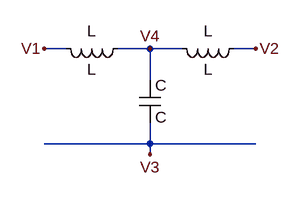
[diagram p0: schematic circuito_t.asc]
circuito_t.asc, the LTspice schematic file:
Version 4.1
SHEET 1 880 680
WIRE 0 128 -32 128
WIRE 128 128 80 128
WIRE 176 128 128 128
WIRE 288 128 256 128
WIRE 128 176 128 128
WIRE 128 272 128 240
WIRE 128 272 -32 272
WIRE 288 272 128 272
WIRE 128 288 128 272
FLAG -32 128 V1
FLAG 288 128 V2
FLAG 128 288 V3
FLAG 128 128 V4
SYMBOL ind 96 112 R90
WINDOW 0 5 56 VBottom 2
WINDOW 3 32 56 VTop 2
SYMATTR InstName L
SYMBOL ind 272 112 R90
WINDOW 0 5 56 VBottom 2
WINDOW 3 32 56 VTop 2
SYMATTR InstName L
SYMBOL cap 112 176 R0
SYMATTR InstName C

The netlist it stands for:
* circuito_t.asc
L V4 V1 L
L V2 V4 L
C V4 V3 C
.backanno
.end